# Altium schematic sheet Reflectance_Sensors_SCH.SchDoc: Reflectance_Sensors_SCH
size A3; Author: Patryk Bujak; Revision: 1.0; SheetNumber: 1; SheetTotal: 1
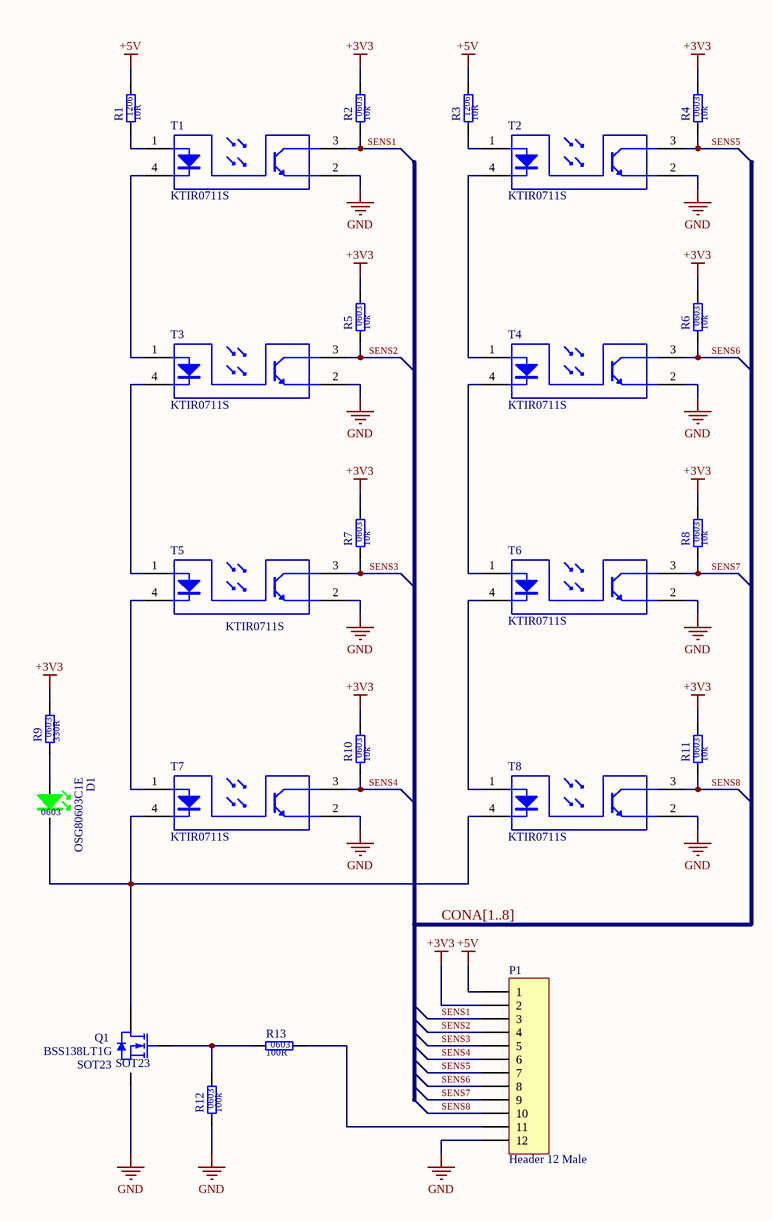
[diagram p0: Reflectance_Sensors_SCH.SchDoc]

## Parts
D1  value OSG80603C1E  SCH_Footprint: 0603  [OL_0603_1608]  (hidden comment: Green led)
P1  Header 12 Male  [H1X12_LONG]
Q1  SCH_Footprint: SOT23  [SOT23_TO236_SC59]  (hidden comment: BSS138LT1G)
R1  value 10R  SCH_Footprint: 1206  [R_1206]  (hidden comment: Resistor)
R2  value 10k  SCH_Footprint: 0603  [R_0603]  (hidden comment: Resistor)
R3  value 10R  SCH_Footprint: 1206  [R_1206]  (hidden comment: Resistor)
R4  value 10k  SCH_Footprint: 0603  [R_0603]  (hidden comment: Resistor)
R5  value 10k  SCH_Footprint: 0603  [R_0603]  (hidden comment: Resistor)
R6  value 10k  SCH_Footprint: 0603  [R_0603]  (hidden comment: Resistor)
R7  value 10k  SCH_Footprint: 0603  [R_0603]  (hidden comment: Resistor)
R8  value 10k  SCH_Footprint: 0603  [R_0603]  (hidden comment: Resistor)
R9  value 330R  SCH_Footprint: 0603  [R_0603]  (hidden comment: Resistor)
R10  value 10k  SCH_Footprint: 0603  [R_0603]  (hidden comment: Resistor)
R11  value 10k  SCH_Footprint: 0603  [R_0603]  (hidden comment: Resistor)
R12  value 100k  SCH_Footprint: 0603  [R_0603]  (hidden comment: Resistor)
R13  value 100R  SCH_Footprint: 0603  [R_0603]  (hidden comment: Resistor)
T1  KTIR0711S  [KTIR0711S]
T2  KTIR0711S  [KTIR0711S]
T3  KTIR0711S  [KTIR0711S]
T4  KTIR0711S  [KTIR0711S]
T5  KTIR0711S  [KTIR0711S]
T6  KTIR0711S  [KTIR0711S]
T7  KTIR0711S  [KTIR0711S]
T8  KTIR0711S  [KTIR0711S]

## Nets
+3V3: P1.2 R2.2 R4.2 R5.2 R6.2 R7.2 R8.2 R9.2 R10.2 R11.2
+5V: P1.1 R1.2 R3.2
GND: P1.12 Q1.2(S) R12.1 T1.2(E) T2.2(E) T3.2(E) T4.2(E) T5.2(E) T6.2(E) T7.2(E) T8.2(E)
SENS1: P1.3 R2.1 T1.3(C)
SENS2: P1.4 R5.1 T3.3(C)
SENS3: P1.5 R7.1 T5.3(C)
SENS4: P1.6 R10.1 T7.3(C)
SENS5: P1.7 R4.1 T2.3(C)
SENS6: P1.8 R6.1 T4.3(C)
SENS7: P1.9 R8.1 T6.3(C)
SENS8: P1.10 R11.1 T8.3(C)
NetD1_1: D1.1(K) Q1.3(D) T7.4(K) T8.4(K)
NetD1_2: D1.2(A) R9.1
NetP1_11: P1.11 R13.2
NetQ1_1: Q1.1(G) R12.2 R13.1
NetR1_1: R1.1 T1.1(A)
NetR3_1: R3.1 T2.1(A)
NetT1_4: T1.4(K) T3.1(A)
NetT2_4: T2.4(K) T4.1(A)
NetT3_4: T3.4(K) T5.1(A)
NetT4_4: T4.4(K) T6.1(A)
NetT5_4: T5.4(K) T7.1(A)
NetT6_4: T6.4(K) T8.1(A)

## Buses and harness runs
bus CONA[1..8]

## Notes on the sheet
- Title:
- Sheet:
- of
- Author:
- Model:
- Document Number:
- Checked by:
- Iss-Rev:
- Approved by:
- Date:
- File name:

## Library data of the parts
D1 = OL_G_0603_OSG80603C1E: LED GREEN; Manufacturer: Optosupply; Part Number: OL_G_0603_OSG80603C1E; Manufacturer Part Number: OSG80603C1E; Supplier 1: TME; Supplier Part Number 1: OSG80603C1E; Supplier 2: RS Components; Supplier 3: Farnell; Supplier 4: Mouser; Supplier 5: Digi-Key
P1 = Header 12: Header, 12-Pin; System: Connector; LatestRevisionDate: 17-Jul-2002; LatestRevisionNote: Re-released for DXP Platform.
Q1 = QNS_BSS138LT1G_50V_0A2: Manufacturer: ON Semiconductor; Type: N-MOS; Voltage: 50V; Current: 0A2; Part Number: QNS_BSS138LT1G_50V_0A2; Value: BSS138LT1G; HelpURL: https://datasheet.octopart.com/BSS138LT1G-ON-Semiconductor-datasheet-8332669.pdf; Manufacturer Part Number: BSS138LT1G; Supplier 1: TME; Supplier 2: RS Components; Supplier 3: Farnell; Supplier Part Number 3: 1752037; Supplier 4: Mouser; Supplier Part Number 4: 511-STD3NK80Z; Supplier 5: Digi-Key; Supplier Part Number 5: 497-7968-1-ND
R1 R3 = R_10R_1206_1: Manufacturer: Yageo; Manufacturer Part Number: RC1206FR-0710RL; Voltage: 200V; Power: 250mW; Tolerance: 1%; Part Number: R_10R_1206_1; HelpURL: http://www.farnell.com/datasheets/444357.pdf; Supplier 1: TME; Supplier 2: RS Components; Supplier 3: Farnell; Supplier Part Number 3: 9236643; Supplier 4: Mouser; Supplier Part Number 4: 603-RC1206FR-0710RL; Supplier 5: Digi-Key; Supplier Part Number 5: 311-10.0FRCT-ND
R2 R4-R8 R10 R11 = R_10k_0603_1: Manufacturer: Vishay; Manufacturer Part Number: CRCW060310K0FKTABC; Voltage: 75V; Power: 100mW; Tolerance: 1%; Part Number: R_10k_0603_1; HelpURL: http://www.tme.eu/pl/Document/622e28308c06d160637f2b14751ba16b/Data%20Sheet%20CRCW_BCe3.pdf; Supplier 1: TME; Supplier Part Number 1: CRCW060310K0FKTABC; Supplier 2: RS Components; Supplier 3: Farnell; Supplier 4: Mouser; Supplier Part Number 4: 667-ERJ-3EKF1002V; Supplier 5: Digi-Key; Supplier Part Number 5: P10KGCT-ND
R9 = R_330R_0603_1: Manufacturer: Yageo; Manufacturer Part Number: RC0603FR-07330RL; Voltage: 50V; Power: 100mW; Tolerance: 1%; Part Number: R_330R_0603_1; HelpURL: http://datasheet.octopart.com/RC0603FR-07330RL-Yageo-datasheet-8328172.pdf; Supplier 1: TME; Supplier Part Number 1: RC0603FR-07330R; Supplier 2: RS Components; Supplier Part Number 2: 5046499; Supplier 3: Farnell; Supplier Part Number 3: 9238425; Supplier 4: Mouser; Supplier Part Number 4: 603-RC0603FR-07330RL; Supplier 5: Digi-Key; Supplier Part Number 5: 311-330HRCT-ND
R12 = R_100k_0603_1: Manufacturer: Royalohm; Manufacturer Part Number: 0603SAF1003T5E; Voltage: 50V; Power: 100mW; Tolerance: 1%; Part Number: R_100k_0603_1; HelpURL: http://www.tme.eu/pl/Document/b315665a56acbc42df513c99b390ad98/ROYALOHM-THICKFILM.pdf; Supplier 1: TME; Supplier Part Number 1: SMD0603-100K-1%; Supplier 2: RS Components; Supplier 3: Farnell; Supplier 4: Mouser; Supplier Part Number 4: 667-ERJ-3EKF1003V; Supplier 5: Digi-Key; Supplier Part Number 5: P100KHCT-ND
R13 = R_100R_0603_1: Manufacturer: Yageo; Manufacturer Part Number: RC0603FR-07100RL; Voltage: 50V; Power: 100mW; Tolerance: 1%; Part Number: R_100R_0603_1; HelpURL: http://www.tme.eu/en/Document/d2a72e545e5c8eb7bf2a04fa97535928/rc0603yageo.pdf; Supplier 1: TME; Supplier Part Number 1: RC0603FR-07100R; Supplier 2: RS Components; Supplier 3: Farnell; Supplier Part Number 3: 2131804; Supplier 4: Mouser; Supplier Part Number 4: 603-RC0603FR-07100RL; Supplier 5: Digi-Key; Supplier Part Number 5: 311-100HRCT-ND
T1-T8 = KTIR0711S: Value: *; HelpURL: *; Supplier: *; Supplier Part Number: *